# EAGLE schematic t-rex (EAGLE 9.6.2)
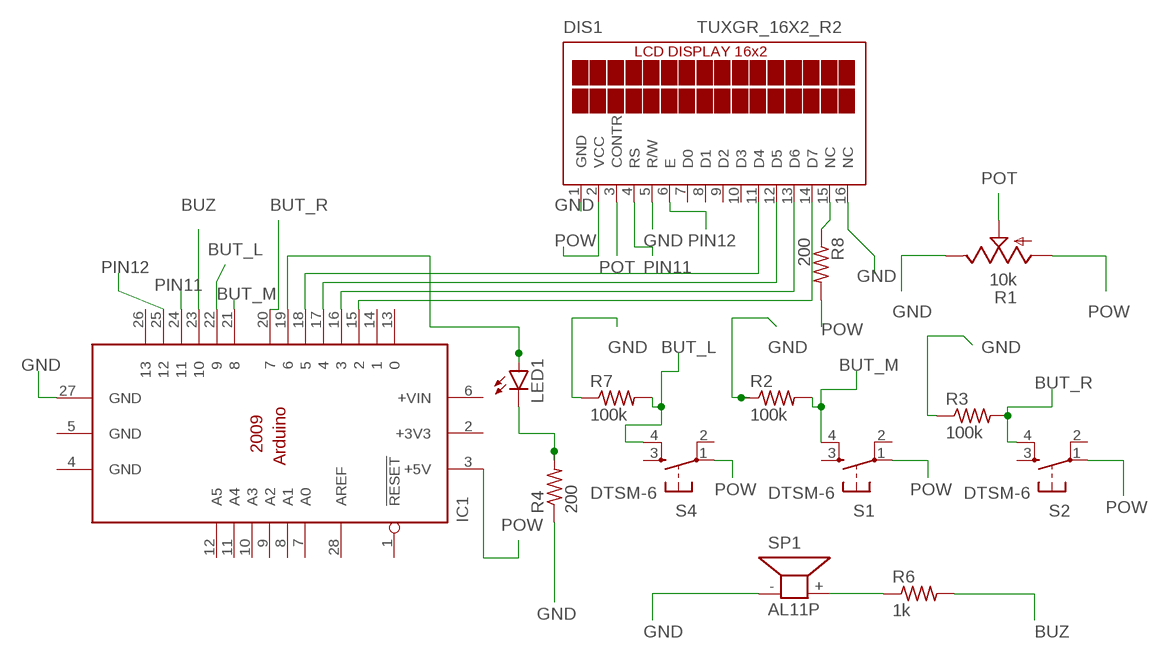
[diagram p0: schematic, sheet 1]

## Parts
DIS1  TUXGR_16X2_R2  [TUXGR_16X2_R2]
IC1  ARDUINO2009_10  [ARDUINO2009]
LED1  LED5MM  [LED5MM]
R1  10k  TRIM_US-PT10  [PT-10]
R2  100k  R-US_0204/7  [0204/7]
R3  100k  R-US_0204/7  [0204/7]
R4  200  R-US_0204/7  [0204/7]
R6  1k  R-US_0204/7  [0204/7]
R7  100k  R-US_0204/7  [0204/7]
R8  200  R-US_0204/7  [0204/7]
S1  DTSM-6  [DTSM-6]
S2  DTSM-6  [DTSM-6]
S4  DTSM-6  [DTSM-6]
SP1  AL11P  [AL11P]

## Nets
BUT_L: IC1.22 R7.2 S4.4
BUT_M: IC1.21 R2.2 S1.4
BUT_R: IC1.20 R3.2 S2.4
BUZ: IC1.23 R6.2
GND: DIS1.1(GND) DIS1.5(R/W) DIS1.16(NC) IC1.27(GND) R1.E R2.1 R3.1 R4.1 R7.1 SP1.-
N$1: DIS1.14(D7) IC1.15
N$2: DIS1.13(D6) IC1.16
N$3: DIS1.12(D5) IC1.17
N$4: IC1.19 LED1.A
N$5: DIS1.11(D4) IC1.18
N$6: LED1.K(C) R4.2
N$7: R6.1 SP1.+
N$8: DIS1.15(NC) R8.1
PIN11: DIS1.4(RS) IC1.24
PIN12: DIS1.6(E) IC1.25
POT: DIS1.3(CONTR) R1.S
POW: DIS1.2(VCC) IC1.3(+5V) R1.A R8.2 S1.1 S2.1 S4.1
Unconnected: DIS1.7(D0) DIS1.8(D1) DIS1.9(D2) DIS1.10(D3) IC1.1(!RESET) IC1.6(+VIN) IC1.7(A0) IC1.8(A1) IC1.9(A2) IC1.10(A3) IC1.11(A4) IC1.12(A5) IC1.13 IC1.14 IC1.26 IC1.28(AREF) S1.2 S1.3 S2.2 S2.3 S4.2 S4.3

## Power pins joined to a net without a drawn wire
+3V3: IC1.2(+3V3)
GND: IC1.4(GND) IC1.5(GND)

## Library data of the parts
DIS1 = display-lcd:TUXGR_16X2_R2: Tuxgraphics LCD display 16x2 characters reflective, without background light Source: tuxgr_12x2_r2.pdf; OC_FARNELL: unknown; OC_NEWARK: unknown
IC1 = arduino:ARDUINO2009_1: The Arduino Duemilanove ("2009") is a microcontroller board based on the ATmega168 or ATmega328. - 14 digital input/output pins (of which 6 can be used as PWM outputs) - 6 analog inputs, a 16 MHz crystal oscillator - USB connection - power jack - ISP header - reset button It contains everything needed to support the microcontroller; simply connect it to a computer with a USB cable or power it with a AC-to-DC adapter or battery to get started http://arduino.cc/en/Main/ArduinoBoardDuemilanove
LED1 = led:LED: LED OSRAM: - CHIPLED LG R971, LG N971, LY N971, LG Q971, LY Q971, LO R971, LY R971 LH N974, LH R974 LS Q976, LO Q976, LY Q976 LO Q996 - Hyper CHIPLED LW Q18S LB Q993, LB Q99A, LB R99A - SideLED LS A670, LO A670, LY A670, LG A670, LP A670 LB A673, LV A673, LT A673, LW A673 LH A674 LY A675 LS A676, LA A676, LO A676, LY A676, LW A676 LS A679, LY A679, LG A679 - Hyper Micro SIDELED® LS Y876, LA Y876, LO Y876, LY Y876 LT Y87S - SmartLED LW L88C, LW L88S LB L89C, LB L89S, LG L890 LS L89K, LO L89K, LY L89K LS L896, LA L896, LO L896, LY L896 - TOPLED LS T670, LO T670, LY T670, LG T670, LP T670 LSG T670, LSP T670, LSY T670, LOP T670, LYG T670 LG T671, LOG T671, LSG T671 LB T673, LV T673, LT T673, LW T673 LH T674 LS T676, LA T676, LO T676, LY T676, LB T676, LH T676, LSB T676, LW T676 LB T67C, LV T67C, LT T67C, LS T67K, LO T67K, LY T67K, LW E67C LS E67B, LA E67B, LO E67B, LY E67B, LB E67C, LV E67C, LT E67C LW T67C LS T679, LY T679, LG T679 LS T770, LO T770, LY T770, LG T770, LP T770 LB T773, LV T773, LT T773, LW T773 LH T774 LS E675, LA E675, LY E675, LS T675 LS T776, LA T776, LO T776, LY T776, LB T776 LHGB T686 LT T68C, LB T68C - Hyper Mini TOPLED® LB M676 - Mini TOPLED Santana® LG M470 LS M47K, LO M47K, LY M47K Source: http://www.osram.convergy.de LUXEON: - LUMILED® LXK2-PW12-R00, LXK2-PW12-S00, LXK2-PW14-U00, LXK2-PW14-V00 LXK2-PM12-R00, LXK2-PM12-S00, LXK2-PM14-U00 LXK2-PE12-Q00, LXK2-PE12-R00, LXK2-PE12-S00, LXK2-PE14-T00, LXK2-PE14-U00 LXK2-PB12-K00, LXK2-PB12-L00, LXK2-PB12-M00, LXK2-PB14-N00, LXK2-PB14-P00, LXK2-PB14-Q00 LXK2-PR12-L00, LXK2-PR12-M00, LXK2-PR14-Q00, LXK2-PR14-R00 LXK2-PD12-Q00, LXK2-PD12-R00, LXK2-PD12-S00 LXK2-PH12-R00, LXK2-PH12-S00 LXK2-PL12-P00, LXK2-PL12-Q00, LXK2-PL12-R00 Source: www.luxeon.com KINGBRIGHT: KA-3528ASYC Source: www.kingbright.com
R1 = pot:TRIM_US-: POTENTIOMETER
R2-R4 R6-R8 = rcl:R-US_: RESISTOR, American symbol; SPICEPREFIX: R
S1 S2 S4 = switch-tact:DTSM-6
SP1 = buzzer:AL11P: SPEAKER Source: Buerklin; OC_FARNELL: unknown; OC_NEWARK: unknown